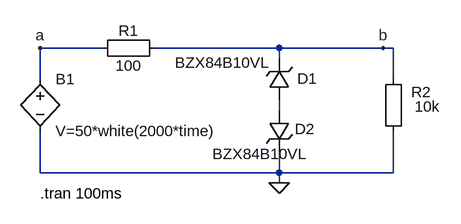
[diagram p0: schematic VL-P-B3.asc]
VL-P-B3.asc, the LTspice schematic file:
Version 4
SHEET 1 880 680
WIRE -96 112 -192 112
WIRE 176 112 -16 112
WIRE 336 112 176 112
WIRE 352 112 336 112
WIRE 176 128 176 112
WIRE -192 160 -192 112
WIRE 352 160 352 112
WIRE 176 208 176 192
WIRE -192 304 -192 240
WIRE 176 304 176 272
WIRE 176 304 -192 304
WIRE 352 304 352 240
WIRE 352 304 176 304
WIRE 176 320 176 304
FLAG -192 112 a
FLAG 336 112 b
FLAG 176 320 0
SYMBOL Misc\\EuropeanResistor 0 96 R90
WINDOW 0 5 56 VBottom 2
WINDOW 3 27 56 VTop 2
SYMATTR InstName R1
SYMATTR Value 100
SYMBOL zener 192 192 R180
WINDOW 0 -43 33 Left 2
WINDOW 3 31 58 Left 2
SYMATTR InstName D1
SYMATTR Value BZX84B10VL
SYMATTR Description Diode
SYMATTR Type diode
SYMBOL Misc\\EuropeanResistor 368 256 R180
WINDOW 0 -42 76 Left 2
WINDOW 3 -56 54 Left 2
SYMATTR InstName R2
SYMATTR Value 10k
SYMBOL zener 160 208 R0
WINDOW 0 40 29 Left 2
WINDOW 3 -87 67 Left 2
SYMATTR InstName D2
SYMATTR Value BZX84B10VL
SYMATTR Description Diode
SYMATTR Type diode
SYMBOL bv -192 144 R0
SYMATTR InstName B1
SYMATTR Value V=50*white(2000*time)
TEXT -192 336 Left 2 !.tran 100ms

The netlist it stands for:
* VL-P-B3.asc
R1 b a 100
D1 N001 b BZX84B10VL
R2 0 b 10k
D2 N001 0 BZX84B10VL
B1 a 0 V=50*white(2000*time)
.model D D
.lib standard.dio
.tran 100ms
.backanno
.end